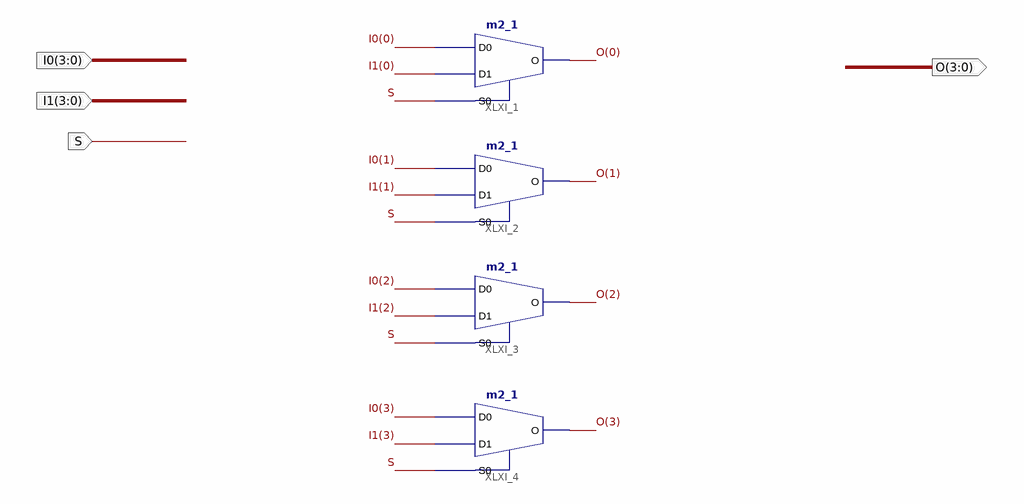
[diagram p0: schematic sheet 1]
// Xilinx ISE schematic mux4b2.sch (spartan3e) as structural Verilog: 4 symbols, 4 ports
module mux4b2 (
  input  [3:0] I0,
  input  [3:0] I1,
  input  S,
  output [3:0] O
);

  m2_1 XLXI_1 (.D0(I0[0]), .D1(I1[0]), .S0(S), .O(O[0]));
  m2_1 XLXI_2 (.D0(I0[1]), .D1(I1[1]), .S0(S), .O(O[1]));
  m2_1 XLXI_3 (.D0(I0[2]), .D1(I1[2]), .S0(S), .O(O[2]));
  m2_1 XLXI_4 (.D0(I0[3]), .D1(I1[3]), .S0(S), .O(O[3]));
endmodule
